# EAGLE design HOLDUP (EAGLE 9.2.1)
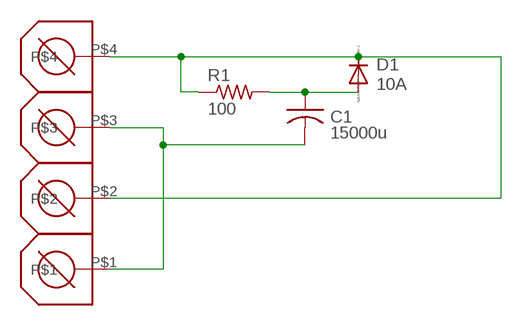
[diagram p0: schematic, sheet 1]

## Parts
C1  15000u  AIR_HOLDUP_CAP  [CAPPRD750W65D1800H3700B]
D1  10A  AIR_HOLDUP_DIODE  [DIOAD1570W120L850D500B]
J1  TE_282834-4  [282834-4_FOOT]
R1  100  AIR_HOLDUP_RESISTOR  [RESAD976W63L650D250B]

## Nets
N$1: D1.1(C) J1.P$2 J1.P$4 R1.1
N$2: C1.2 J1.P$1 J1.P$3
N$3: C1.1 D1.2(A) R1.2

## Library data of the parts
C1 = 111_Custom:AIR_HOLDUP_CAP
D1 = 111_Custom:AIR_HOLDUP_DIODE
J1 = 111_Custom:TE_282834-4
R1 = 111_Custom:AIR_HOLDUP_RESISTOR

## Net classes
0 default: width 1.5 mm, clearance 0.2 mm

## Board
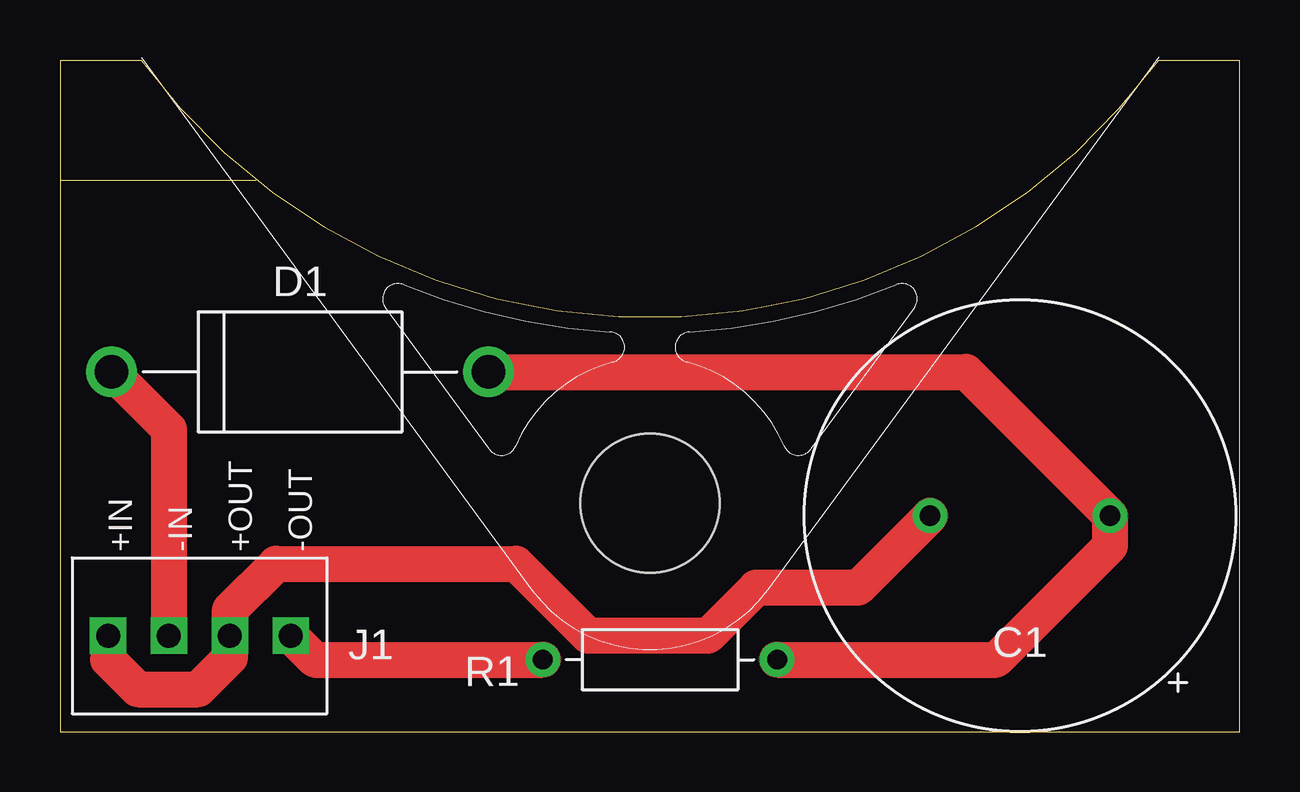
[diagram p1: board, top side]
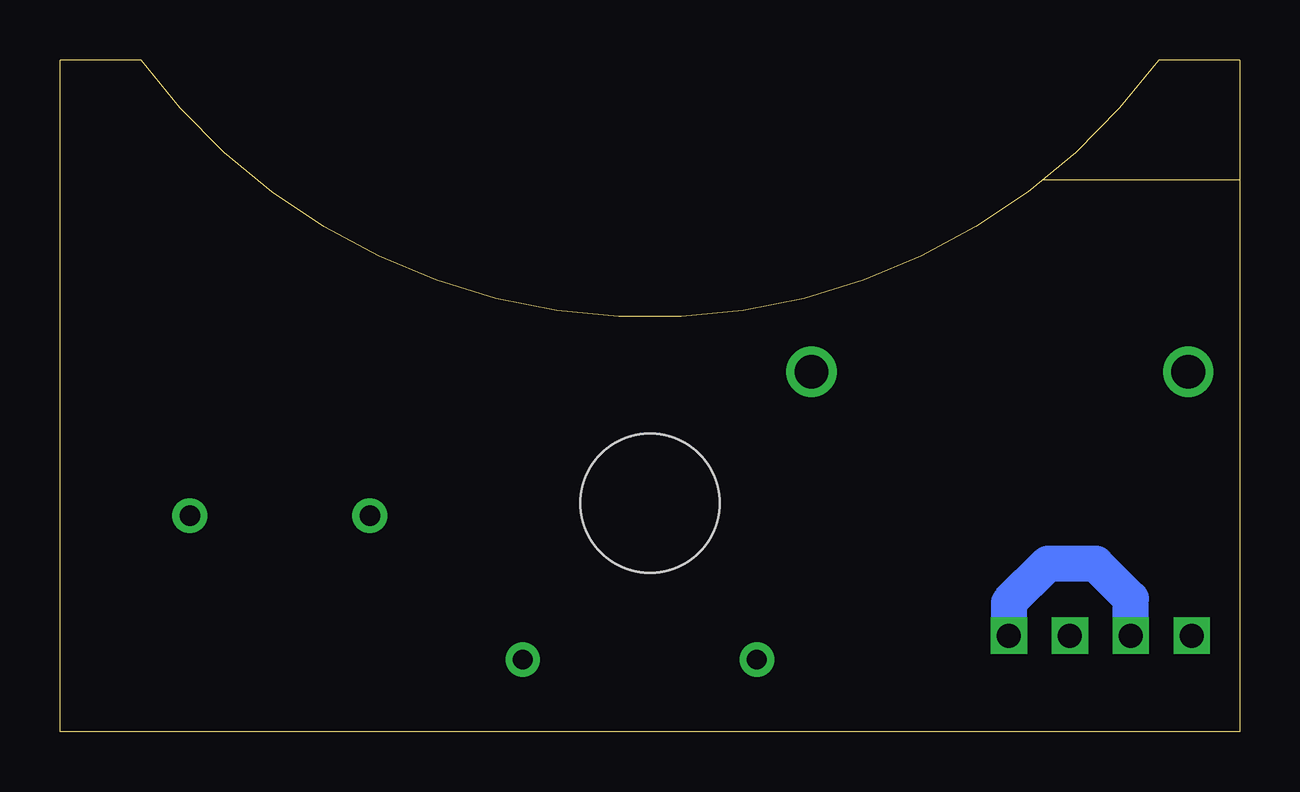
[diagram p2: board, bottom side, seen from below]

Size 49.16 x 28 mm. Coordinates in mm from the lower left corner, seen from the top.
Outline: 0,23 0,28 3.38,28 arc107 45.78,28 49.16,28 49.16,0 0,0 0,23
Outline: 0,23 8.19,23
Copper layers (1*16): Top 0.035mm / dielectric 1.5mm / Bottom 0.035mm
Design rules "default": minimum track width 6mil, minimum drill 0.35mm, track to track 6mil, track to pad 6mil, pad to pad 6mil, via to via 6mil, smd to smd 6mil, copper to edge 40mil, drill to drill 6mil, minimum pad ring 10mil, minimum via ring 8mil, stop-mask expansion 4mil, vias tented up to drill 0mil, thermal gap 10mil
Holes 5.8 mm at 24.58,9.52

### Footprints (pad centres in the part's own frame; a part is rotated, then mirrored left to right if it is on the bottom)
CAPPRD750W65D1800H3700B = drill 0.85 pad 1.45: 1 -3.75,0; 2 3.75,0
DIOAD1570W120L850D500B = drill 1.4 pad 2.1: 1 -7.85,0; 2 7.85,0
282834-4_FOOT = drill 1 square: P$1 0,0; P$2 2.54,0; P$3 5.08,0; P$4 7.62,0
RESAD976W63L650D250B = drill 0.83 pad 1.43: 1 -4.88,0; 2 4.88,0

### Placement (x,y rotation side)
C1  40,9 180 top
D1  10,15 0 top
J1  2,4 0 top
R1  25,3 0 top

### Tracks (layer width: path | path; a pad name or v marks a point on that pad's centre or on a via)
N$1
  Top 1.5: D1.1 4.54,12.61 J1.P$2 | J1.P$4 10.62,3 R1.1
  Bottom 1.5: J1.P$2 4.54,5.54 6,7 8,7 9.62,5.38 J1.P$4
N$2
  Top 1.5: J1.P$1 2,3 3.23,1.77 5.77,1.77 7.08,3.08 J1.P$3 7.08,5.08 9,7 19,7 22,4 27,4 29,6 33.25,6 C1.2
N$3
  Top 1.5: R1.2 39,3 43.75,7.75 C1.1 37.75,15 D1.2

### Text on the board
tPlace: +IN | -IN | +OUT | -OUT